# EAGLE design g2t (EAGLE 7.7.0)
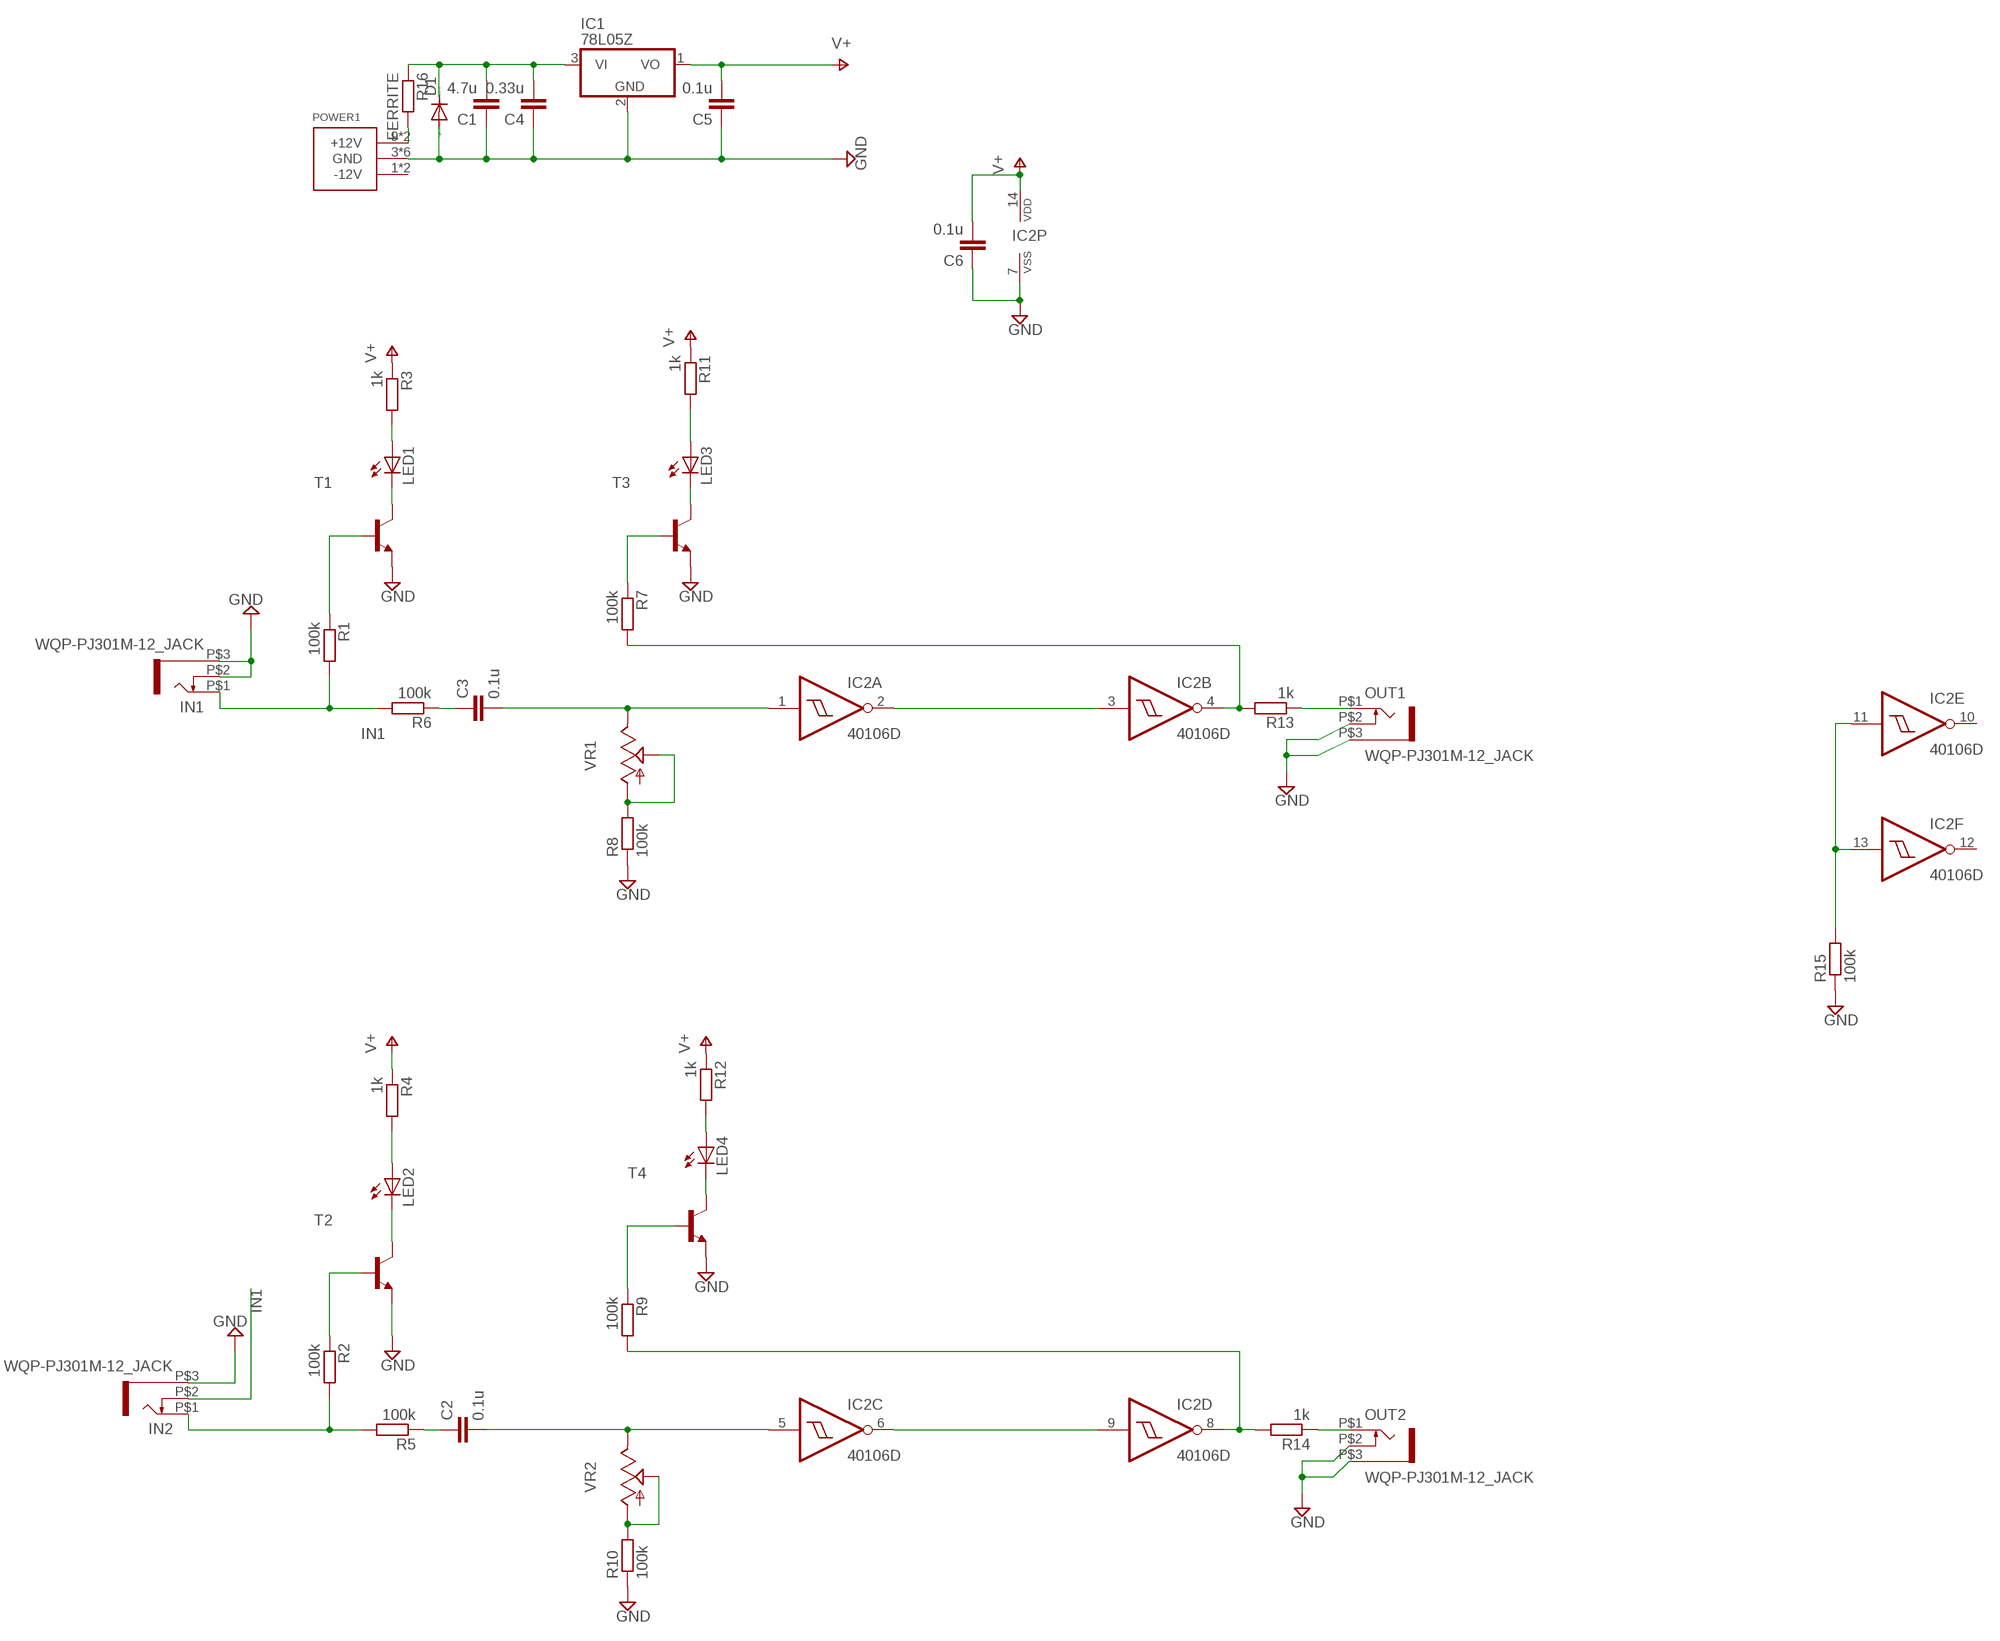
[diagram p0: schematic, sheet 1]

## Parts
C1  4.7u  C-EUC0805  [C0805]
C2  0.1u  C-EUC0805  [C0805]
C3  0.1u  C-EUC0805  [C0805]
C4  0.33u  C-EUC0805  [C0805]
C5  0.1u  C-EUC0805  [C0805]
C6  0.1u  C-EUC0805  [C0805]
D1  DIODE-SOD323-W  [SOD323-W]
IC1  78L05Z  [TO92]
IC2  40106D  [SO14]
IN1  WQP-PJ301M-12_JACK  [WQP-PJ301M-12_JACK]
IN2  WQP-PJ301M-12_JACK  [WQP-PJ301M-12_JACK]
LED1  LEDCHIP-LED0805  [CHIP-LED0805]
LED2  LEDCHIP-LED0805  [CHIP-LED0805]
LED3  LEDCHIP-LED0805  [CHIP-LED0805]
LED4  LEDCHIP-LED0805  [CHIP-LED0805]
OUT1  WQP-PJ301M-12_JACK  [WQP-PJ301M-12_JACK]
OUT2  WQP-PJ301M-12_JACK  [WQP-PJ301M-12_JACK]
POWER1  POWER_SIMPLE10  [POWER_10]
R1  100k  R-EU_R0805  [R0805]
R2  100k  R-EU_R0805  [R0805]
R3  1k  R-EU_R0805  [R0805]
R4  1k  R-EU_R0805  [R0805]
R5  100k  R-EU_R0805  [R0805]
R6  100k  R-EU_R0805  [R0805]
R7  100k  R-EU_R0805  [R0805]
R8  100k  R-EU_R0805  [R0805]
R9  100k  R-EU_R0805  [R0805]
R10  100k  R-EU_R0805  [R0805]
R11  1k  R-EU_R0805  [R0805]
R12  1k  R-EU_R0805  [R0805]
R13  1k  R-EU_R0805  [R0805]
R14  1k  R-EU_R0805  [R0805]
R15  100k  R-EU_R0805  [R0805]
R16  FERRITE  R-EU_R0805  [R0805]
T1  MMBT3904LT1-NPN-SOT23-BEC  [SOT23-BEC]
T2  MMBT3904LT1-NPN-SOT23-BEC  [SOT23-BEC]
T3  MMBT3904LT1-NPN-SOT23-BEC  [SOT23-BEC]
T4  MMBT3904LT1-NPN-SOT23-BEC  [SOT23-BEC]
VR1  9MM_SNAP-IN_POT_  [9MM_SNAP-IN_POT]
VR2  9MM_SNAP-IN_POT_  [9MM_SNAP-IN_POT]

## Nets
GND: C1.1 C4.1 C5.1 C6.1 D1.A IC1.2(GND) IC2.7(P:VSS) IN1.P$2 IN1.P$3 IN2.P$3 OUT1.P$2 OUT1.P$3 OUT2.P$2 OUT2.P$3 POWER1.3(GND) POWER1.4(GND) POWER1.5(GND) POWER1.6(GND) POWER1.7(GND) POWER1.8(GND) R8.1 R10.1 R15.1 T1.E T2.E T3.E T4.E
IN1: IN1.P$1 IN2.P$2 R1.2 R6.2
IN2: IN2.P$1 R2.2 R5.2
N$1: IC2.2(A:O) IC2.3(B:I)
N$2: IC2.6(C:O) IC2.9(D:I)
N$3: IC2.11(E:I) IC2.13(F:I) R15.2
N$4: C2.2 IC2.5(C:I) VR2.3(E)
N$5: C3.2 IC2.1(A:I) VR1.3(E)
N$6: R8.2 VR1.1(A) VR1.2(S)
N$7: R10.2 VR2.1(A) VR2.2(S)
N$8: R1.1 T1.B
N$9: POWER1.9(+12V) POWER1.10(+12V) R16.2
N$10: IC2.8(D:O) R9.2 R14.2
N$11: OUT2.P$1 R14.1
N$12: IC2.4(B:O) R7.2 R13.2
N$13: R7.1 T3.B
N$14: C2.1 R5.1
N$15: C1.2 C4.2 D1.C IC1.3(VI) R16.1
N$16: C3.1 R6.1
N$17: R9.1 T4.B
N$18: LED3.C T3.C
N$19: LED3.A R11.2
N$20: LED4.C T4.C
N$21: LED4.A R12.2
N$22: LED1.C T1.C
N$23: LED1.A R3.2
N$24: R2.1 T2.B
N$25: LED2.C T2.C
N$26: LED2.A R4.2
OUT1: OUT1.P$1 R13.1
V+: C5.2 C6.2 IC1.1(VO) IC2.14(P:VDD) R3.1 R4.1 R11.1 R12.1
Unconnected: IC2.10(E:O) IC2.12(F:O) POWER1.1(-12V) POWER1.2(-12V)

## Library data of the parts
C1-C6 = rcl:C-EU: CAPACITOR, European symbol
D1 = diode:DIODE-: DIODE
IC1 = linear:78*: Positive VOLTAGE REGULATOR Source: http://cache.national.com/ds/LM/LM78L05.pdf http://www.fairchildsemi.com/ds/LM/LM7805.pdf
IC2 = 40xx:40106: Hex SCHMITT TRIGGER
IN1 IN2 OUT1 OUT2 = thonkiconn:WQP-PJ301M-12_JACK
LED1-LED4 = led:LED: LED OSRAM: - CHIPLED LG R971, LG N971, LY N971, LG Q971, LY Q971, LO R971, LY R971 LH N974, LH R974 LS Q976, LO Q976, LY Q976 LO Q996 - Hyper CHIPLED LW Q18S LB Q993, LB Q99A, LB R99A - SideLED LS A670, LO A670, LY A670, LG A670, LP A670 LB A673, LV A673, LT A673, LW A673 LH A674 LY A675 LS A676, LA A676, LO A676, LY A676, LW A676 LS A679, LY A679, LG A679 - Hyper Micro SIDELED® LS Y876, LA Y876, LO Y876, LY Y876 LT Y87S - SmartLED LW L88C, LW L88S LB L89C, LB L89S, LG L890 LS L89K, LO L89K, LY L89K LS L896, LA L896, LO L896, LY L896 - TOPLED LS T670, LO T670, LY T670, LG T670, LP T670 LSG T670, LSP T670, LSY T670, LOP T670, LYG T670 LG T671, LOG T671, LSG T671 LB T673, LV T673, LT T673, LW T673 LH T674 LS T676, LA T676, LO T676, LY T676, LB T676, LH T676, LSB T676, LW T676 LB T67C, LV T67C, LT T67C, LS T67K, LO T67K, LY T67K, LW E67C LS E67B, LA E67B, LO E67B, LY E67B, LB E67C, LV E67C, LT E67C LW T67C LS T679, LY T679, LG T679 LS T770, LO T770, LY T770, LG T770, LP T770 LB T773, LV T773, LT T773, LW T773 LH T774 LS E675, LA E675, LY E675, LS T675 LS T776, LA T776, LO T776, LY T776, LB T776 LHGB T686 LT T68C, LB T68C - Hyper Mini TOPLED® LB M676 - Mini TOPLED Santana® LG M470 LS M47K, LO M47K, LY M47K Source: http://www.osram.convergy.de LUXEON: - LUMILED® LXK2-PW12-R00, LXK2-PW12-S00, LXK2-PW14-U00, LXK2-PW14-V00 LXK2-PM12-R00, LXK2-PM12-S00, LXK2-PM14-U00 LXK2-PE12-Q00, LXK2-PE12-R00, LXK2-PE12-S00, LXK2-PE14-T00, LXK2-PE14-U00 LXK2-PB12-K00, LXK2-PB12-L00, LXK2-PB12-M00, LXK2-PB14-N00, LXK2-PB14-P00, LXK2-PB14-Q00 LXK2-PR12-L00, LXK2-PR12-M00, LXK2-PR14-Q00, LXK2-PR14-R00 LXK2-PD12-Q00, LXK2-PD12-R00, LXK2-PD12-S00 LXK2-PH12-R00, LXK2-PH12-S00 LXK2-PL12-P00, LXK2-PL12-Q00, LXK2-PL12-R00 Source: www.luxeon.com KINGBRIGHT: KA-3528ASYC Source: www.kingbright.com
POWER1 = eurorack:POWER_SIMPLE
R1-R16 = rcl:R-EU_: RESISTOR, European symbol
T1-T4 = transistor-neu-to92:*-NPN-: NPN Transistror
VR1 VR2 = MusicThingModular:9MM_SNAP-IN_POT: 9mm vertical snap-in pot, Alpha / Panasonic style

## Board
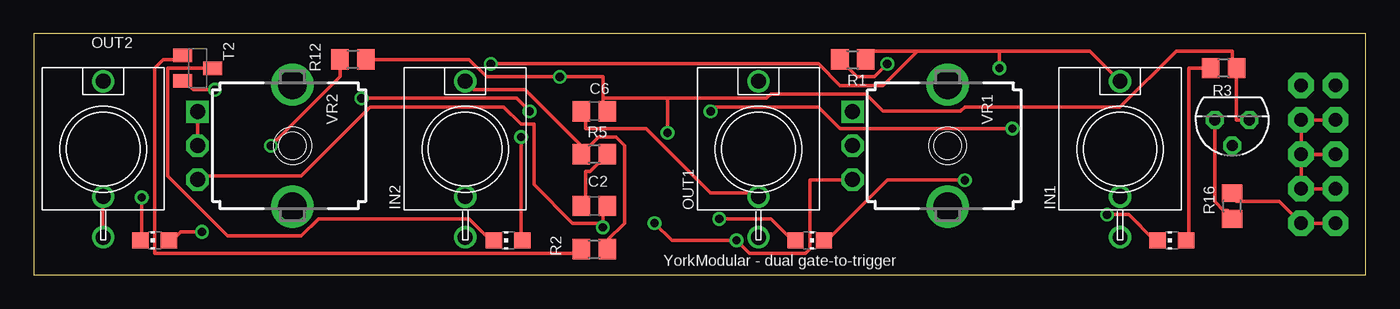
[diagram p1: board, top side]
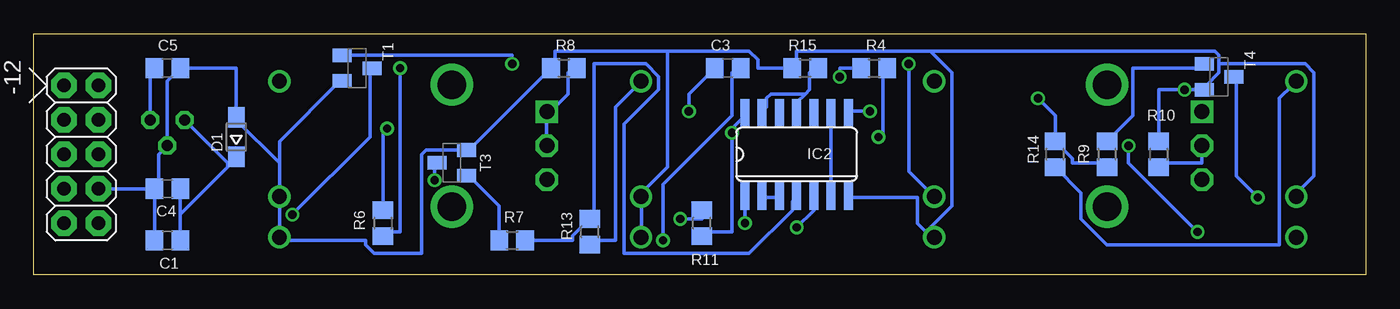
[diagram p2: board, bottom side, seen from below]

Size 98.09 x 17.77 mm. Coordinates in mm from the lower left corner, seen from the top.
Outline: 0,0 98.09,0 98.09,17.77 0,17.77 0,0
Copper layers (1*16): Top 0.035mm / dielectric 1.5mm / Bottom 0.035mm
Design rules "default": minimum track width 10mil, minimum drill 24mil, track to track 8mil, track to pad 8mil, pad to pad 8mil, via to via 8mil, smd to smd 8mil, copper to edge 40mil, drill to drill 8mil, minimum pad ring 10mil, minimum via ring 8mil, stop-mask expansion 4mil, vias tented up to drill 0mil, thermal gap 10mil

### Footprints (pad centres in the part's own frame; a part is rotated, then mirrored left to right if it is on the bottom)
C0805 = smd 1.3 x 1.5: 1 -0.95,0; 2 0.95,0
SOD323-W = smd 1.5 x 1.2: A 1.45,0; C -1.45,0
TO92 = drill 0.813 octagon: 1 -1.27,0; 2 0,1.905; 3 1.27,0
SO14 = smd 0.66 x 2.032: 1 -3.81,-3.073; 2 -2.54,-3.073; 3 -1.27,-3.073; 4 0,-3.073; 5 1.27,-3.073; 6 2.54,-3.073; 7 3.81,-3.073; 8 3.81,3.073; 9 2.54,3.073; 10 1.27,3.073; 11 0,3.073; 12 -1.27,3.073; 13 -2.54,3.073; 14 -3.81,3.073
WQP-PJ301M-12_JACK = drill 1.1: P$1 0,5; P$2 0,-3.5; P$3 0,-6.5
CHIP-LED0805 = smd 1.2 x 1.2: A 0,-1.05; C 0,1.05
POWER_10 = drill 1.016 pad 1.88 octagon: 1 -5.08,-1.27; 2 -5.08,1.27; 3 -2.54,-1.27; 4 -2.54,1.27; 5 0,-1.27; 6 0,1.27; 7 2.54,-1.27; 8 2.54,1.27; 9 5.08,-1.27; 10 5.08,1.27
R0805 = smd 1.3 x 1.5: 1 -0.95,0; 2 0.95,0
SOT23-BEC = smd 1 x 1.4: B -0.95,-1.1; C 0,1.1; E 0.95,-1.1
9MM_SNAP-IN_POT = drill 1.1 square: 1 -2.5,-7 | drill 1.1 octagon: 2 0,-7; 3 2.5,-7 | drill 2.1 pad 2.794: CHASSIS1 -4.5,0; CHASSIS2 4.5,0

### Placement (x,y rotation side)
C1  88.27,2.54 0 bottom
C2  41.27,5.08 0 top
C3  46.99,15.24 0 bottom
C4  88.27,6.35 0 bottom
C5  88.27,15.24 180 bottom
C6  41.27,12.06 0 top
D1  83.19,10.16 90 bottom
IC1  88.27,11.43 180 top
IC2  41.91,8.89 0 bottom
IN1  80.02,9.28 0 top
IN2  31.77,9.28 0 top
LED1  83.82,2.54 90 top
LED2  34.92,2.54 90 top
LED3  57.15,2.54 270 top
LED4  8.89,2.54 90 top
OUT1  53.38,9.28 0 top
OUT2  5.1,9.28 0 top
POWER1  94.61,8.89 270 bottom
R1  60.32,15.88 0 top
R2  41.27,1.91 0 top
R3  87.63,15.24 180 top
R4  36.2,15.24 0 bottom
R5  41.27,8.89 180 top
R6  72.39,3.81 270 bottom
R7  62.86,2.54 0 bottom
R8  59.05,15.24 0 bottom
R9  19.05,8.89 270 bottom
R10  15.24,8.89 270 bottom
R11  48.89,3.81 90 bottom
R12  23.49,15.88 180 top
R13  57.15,3.17 90 bottom
R14  22.86,8.89 90 bottom
R15  41.27,15.24 0 bottom
R16  88.27,5.08 90 top
T1  74.3,15.24 270 bottom
T2  12.07,15.24 270 top
T3  67.31,8.26 90 bottom
T4  10.79,14.61 270 bottom
VR1  67.31,9.53 270 top
VR2  19.05,9.53 270 top

### Tracks (layer width: path | path; a pad name or v marks a point on that pad's centre or on a via)
GND  (via drill 0.61)
  Top 0.254: POWER1.3 POWER1.4 POWER1.6 | POWER1.6 POWER1.8 POWER1.7 | POWER1.6 POWER1.5 | C6.1 40.64,12.06 40.64,10.79 45.09,10.79 49.85,6.03 53.34,6.03 OUT1.P$2 | OUT2.P$3 5.08,2.86 5.08,5.71 OUT2.P$2 | v13.34,13.65 11.75,13.65 11.11,14.29 T2.E
  Bottom 0.254: C4.1 C1.1 | POWER1.8 C4.1 | C4.1 88.9,6.35 88.9,8.89 IC1.2 88.27,14.29 87.63,14.92 87.63,15.24 C5.1 83.19,15.24 D1.A 83.19,11.43 80.01,8.26 | 80.01,8.26 80.01,6.03 IN1.P$2 80.01,5.71 80.01,2.86 IN1.P$3 80.01,2.54 73.66,2.54 73.66,2.22 73.03,1.59 69.53,1.59 69.53,8.89 69.22,9.21 66.36,9.21 T3.E 66.04,9.21 R8.1 59.69,15.24 59.69,16.51 51.44,16.51 | 80.01,8.26 80.01,9.84 75.56,14.29 T1.E | OUT1.P$3 53.34,2.86 53.34,5.71 OUT1.P$2 53.34,6.03 51.44,7.94 51.44,16.51 | R10.1 15.24,13.65 v13.34,13.65 12.07,13.65 T4.E 11.75,13.97 10.79,14.92 10.79,15.56 | 10.79,15.56 4.44,15.56 3.81,14.92 3.81,7.3 5.08,6.03 OUT2.P$2 | 32.38,3.17 32.07,2.86 IN2.P$3 32.38,3.17 | 32.38,3.17 33.02,3.81 33.02,5.71 38.1,5.71 IC2.7 | 51.44,16.51 45.4,16.51 44.77,15.88 44.77,15.24 R15.1 41.91,15.24 41.91,16.51 32.07,16.51 | 32.38,3.17 30.48,5.08 30.48,14.92 32.07,16.51 | 10.79,15.56 10.79,16.19 11.11,16.51 32.07,16.51
IN1  (via drill 0.61)
  Top 0.254: 71.12,16.51 77.79,16.51 IN1.P$1 | 71.12,16.51 65.09,16.51 | 65.09,16.51 61.91,16.51 R1.2 | 71.12,16.51 v71.12,15.24 | v33.66,15.56 57.78,15.56 59.37,13.97 62.55,13.97 65.09,16.51
  Bottom 0.254: v71.12,15.24 71.12,3.17 72.39,3.17 R6.2 | v33.66,15.56 33.66,7.62 32.07,6.03 IN2.P$2
IN2
  Top 0.254: 40.64,9.21 R5.2 40.64,9.21 | 40.64,9.21 41.59,10.16 42.86,10.16 43.5,9.53 43.5,3.81 42.23,2.54 R2.2 | 40.64,9.21 36.2,13.65 32.38,13.65 32.07,13.97 IN2.P$1
N$1
  Bottom 0.254: IC2.3 43.18,5.71 44.45,5.71 IC2.2
N$2
  Bottom 0.254: IC2.9 IC2.6
N$3
  Bottom 0.254: 41.27,13.34 41.91,12.7 IC2.11 | 41.27,13.34 40.96,13.65 40.96,14.92 40.64,15.24 R15.2 | 41.27,13.34 43.81,13.34 44.13,13.02 44.13,12.38 44.45,12.06 IC2.13
N$4  (via drill 0.61)
  Top 0.254: 41.91,3.81 41.91,5.08 C2.2 | 41.91,3.81 39.69,3.81 36.83,6.67 36.83,11.11 35.88,11.11 34.61,12.38 24.77,12.38 19.68,7.3 12.07,7.3 VR2.3 | 41.91,3.81 v41.91,3.49
  Bottom 0.254: v41.91,3.49 40.64,4.76 IC2.5
N$5  (via drill 0.61)
  Top 0.254: VR1.3 60.01,6.99 57.15,6.99 57.15,1.91 56.83,1.59 52.7,1.59 v51.75,2.54 46.99,2.54 v45.72,3.81
  Bottom 0.254: v51.75,2.54 51.75,6.67 46.67,11.75 46.67,14.92 46.35,15.24 C3.2 | v45.72,3.81 IC2.1
N$6
  Bottom 0.254: R8.2 58.42,15.24 58.74,14.92 58.74,13.34 60.01,12.06 VR1.1 60.32,11.75 VR1.2
N$7
  Top 0.254: VR2.1 12.07,11.75 12.07,9.53 VR2.2
  Bottom 0.254: R10.2 15.24,8.26 12.07,8.26 12.07,9.53 VR2.2
N$8  (via drill 0.61)
  Top 0.254: v62.86,15.56 61.91,14.61 60.64,14.61 R1.1
  Bottom 0.254: v62.86,15.56 62.86,16.19 75.25,16.19 T1.B
N$9
  Top 0.254: R16.2 88.27,5.71 88.58,5.4 91.76,5.4 POWER1.10 POWER1.9
N$10  (via drill 0.61)
  Top 0.254: v36.51,12.06 35.56,13.02 v24.13,13.02
  Bottom 0.254: R14.2 21.59,8.57 21.59,8.26 19.05,8.26 R9.2 | v36.51,12.06 38.1,12.06 IC2.8 | v24.13,13.02 22.86,11.75 R14.2 | R14.2
N$11
  Bottom 0.254: R14.1 20.95,6.03 20.95,4.13 19.05,2.22 6.35,2.22 6.35,13.02 5.4,13.97 OUT2.P$1
N$12
  Bottom 0.254: R7.2 58.42,2.54 58.42,2.86 R13.2 | R13.2 56.83,4.45 56.83,15.56 53.02,15.56 52.07,14.61 52.07,13.65 54.61,11.11 54.61,1.59 45.4,1.59 42.23,4.76 42.23,5.4 41.91,5.71 IC2.4 | R13.2
N$13
  Bottom 0.254: T3.B 66.04,7.3 63.82,5.08 R7.1
N$14
  Top 0.254: C2.1 40.64,5.08 40.64,7.62 40.96,7.62 R5.1
N$15
  Top 0.254: IC1.3 87,5.4 87.63,4.76 87.95,4.76 88.27,4.45 R16.1
  Bottom 0.254: 87.31,4.45 C4.2 | 87.31,4.45 C1.2 | 87.31,4.45 83.82,7.94 | 83.82,7.94 83.19,8.57 D1.C | IC1.3 83.82,8.26 83.82,7.94
N$16  (via drill 0.61)
  Top 0.254: v49.85,12.06 50.16,12.38 57.78,12.38 59.37,10.79 v72.07,10.79
  Bottom 0.254: v49.85,12.06 49.85,13.34 C3.1 | v72.07,10.79 72.39,10.48 R6.1
N$17
  Bottom 0.254: T4.B 12.07,15.24 17.14,15.24 17.14,11.75 R9.1
N$18  (via drill 0.61)
  Top 0.254: v68.58,6.99 62.86,6.99 58.42,2.54 LED3.C
  Bottom 0.254: v68.58,6.99 68.58,8.26 T3.C
N$19  (via drill 0.61)
  Top 0.254: v50.48,4.13 54.29,4.13 55.88,2.54 LED3.A
  Bottom 0.254: v50.48,4.13 48.89,4.13 R11.2
N$20  (via drill 0.61)
  Top 0.254: v7.94,5.71 7.94,2.54 LED4.C
  Bottom 0.254: v7.94,5.71 9.53,7.3 9.53,14.61 T4.C
N$21  (via drill 0.61)
  Top 0.254: v12.38,3.17 10.79,3.17 10.16,2.54 LED4.A | v17.46,9.53 22.54,14.61 R12.2
  Bottom 0.254: v12.38,3.17 17.46,8.26 v17.46,9.53
N$22  (via drill 0.61)
  Top 0.254: v79.06,4.45 80.64,4.45 82.55,2.54 LED1.C
  Bottom 0.254: v79.06,4.45 73.34,10.16 73.34,15.24 T1.C
N$23
  Top 0.254: R3.2 85.09,15.24 85.09,2.54 LED1.A
N$24
  Top 0.254: T2.B 10.79,15.88 9.53,15.88 8.89,15.24 8.89,1.59 40,1.59 R2.1
N$25
  Top 0.254: T2.C 9.84,15.24 9.84,7.3 14.29,2.86 19.68,2.86 20.95,4.13 32.07,4.13 33.66,2.54 LED2.C
N$26  (via drill 0.61)
  Top 0.254: v35.88,10.16 35.88,2.54 LED2.A
  Bottom 0.254: v35.88,10.16 35.56,10.48 35.56,15.24 R4.2
OUT1
  Bottom 0.254: R13.1 57.15,2.54 55.24,2.54 55.24,12.38 53.66,13.97 OUT1.P$1
V+  (via drill 0.61)
  Top 0.254: IC1.1 88.58,11.43 R3.1 88.27,15.24 88.27,16.51 84.14,16.51 80.01,12.38 68.58,12.38 68.26,12.06 62.55,12.06 61.28,13.34 54.29,13.34 53.98,13.02 46.67,13.02 | 41.91,13.02 41.91,14.61 v38.73,14.61 33.34,14.61 32.07,15.88 R12.1 | 41.91,13.02 41.91,12.06 C6.2 | 41.91,13.02 46.67,13.02 | 46.67,13.02 v46.67,10.48
  Bottom 0.254: R11.1 48.89,3.17 46.67,3.17 v46.67,10.48 46.67,10.79 45.72,11.75 IC2.14 | IC1.1 89.53,14.92 C5.2 | R4.1 38.73,15.24 v38.73,14.61

### Text on the board
tNames: YorkModular - dual gate-to-trigger